# Altium schematic sheet P3V3_Regulator.SchDoc: P3V3 DC/DC Converter
size 431 x 279 mm; Organization: ORGANIZATION; Address1: APPLIED PHYSICS LAB; Address2: UNIVERSITY OF WASHINGTON; Address3: 1013 NE 40TH STREET; Address4: SEATTLE, WA 98105; DocumentNumber: 8; Revision: -; SheetNumber: 8; SheetTotal: 18; ENG_APP_DATE: --/--/--; DSN_APP_DATE: --/--/--; CHK_APP_DATE: --/--/--
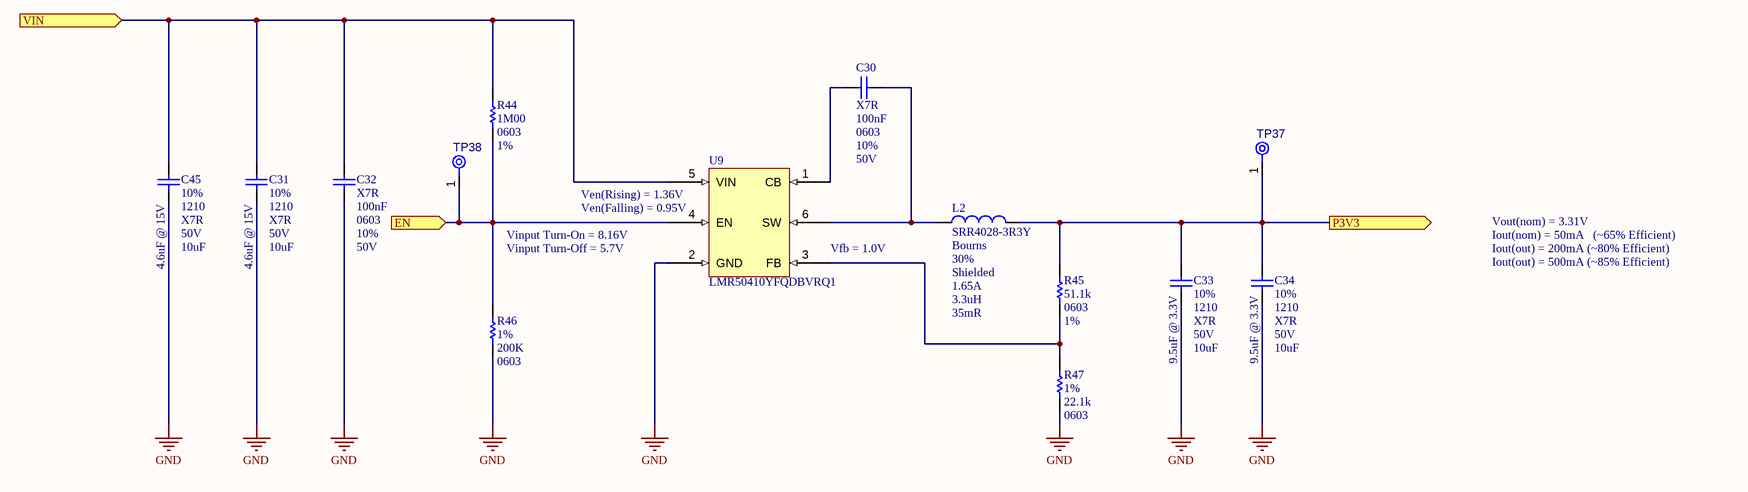
[diagram p0: P3V3_Regulator.SchDoc]

## Parts
C30  value 100nF  Dielectric: X7R  Case/Package: 0603  Tolerance: 10%  Voltage Rating: 50V  [CAPC1608X90X40ML10T20]  (hidden comment: Capacitor 100nF +/- 10%, 50V, X7R, 0603)
C31  value 10uF  Tolerance: 10%  Case/Package: 1210  Dielectric: X7R  Voltage Rating: 50V  [CAPC3225X270X30ML30]  (hidden comment: Capacitor 10uF 10%, 50V, X7R, 1210)
C32  value 100nF  Dielectric: X7R  Case/Package: 0603  Tolerance: 10%  Voltage Rating: 50V  [CAPC1608X90X40ML10T20]  (hidden comment: Capacitor 100nF +/- 10%, 50V, X7R, 0603)
C33  value 10uF  Tolerance: 10%  Case/Package: 1210  Dielectric: X7R  Voltage Rating: 50V  [CAPC3225X270X30ML30]  (hidden comment: Capacitor 10uF 10%, 50V, X7R, 1210)
C34  value 10uF  Tolerance: 10%  Case/Package: 1210  Dielectric: X7R  Voltage Rating: 50V  [CAPC3225X270X30ML30]  (hidden comment: Capacitor 10uF 10%, 50V, X7R, 1210)
C45  value 10uF  Tolerance: 10%  Case/Package: 1210  Dielectric: X7R  Voltage Rating: 50V  [CAPC3225X270X30ML30]  (hidden comment: Capacitor 10uF 10%, 50V, X7R, 1210)
L2  SRR4028-3R3Y  Manufacturer: Bourns  Inductance Tolerance: 30%  Shielding: Shielded  Saturation Current: 1.65A  Inductance: 3.3uH  DC Resistance (DCR): 35mR  [INDP4848X30M]
R44  value 1M00  Case/Package: 0603  Tolerance: 1%  [RESC1609X50X30ML08T20]  (hidden comment: Resistor 1M +/-1% 0603 100 mW)
R45  value 51.1k  Case/Package: 0603  Tolerance: 1%  [RESC1608X55X25ML10T15]  (hidden comment: Resistor 51K1 +/-1% 0603 100 mW)
R46  value 200K  Tolerance: 1%  Case/Package: 0603  [RESC1609X50X30ML08T20]  (hidden comment: Resistor 200K +/-1% 0603 100 mW)
R47  value 22.1k  Tolerance: 1%  Case/Package: 0603  [RESC1608X55X25ML10T15]  (hidden comment: Resistor 22K1 +/-1% 0603 100 mW)
TP37  TPAD6R-CIRCLED  [TP06R - Circled]  (value not drawn)  (no BOM)
TP38  TPAD6R-CIRCLED  [TP06R - Circled]  (value not drawn)  (no BOM)
U9  LMR50410YFQDBVRQ1  [SOT95P280X145-6M]

## Ports
EN (in), P3V3 (out), VIN (in)

## Nets
GND: C31.1 C32.1 C33.1 C34.1 C45.1 R46.1 R47.1 U9.2(GND)
EN: R44.1 R46.2 TP38.1(TP) U9.4(EN) ; port EN
P3V3: C33.2 C34.2 L2.2 R45.1 TP37.1(TP) ; port P3V3
VIN: C31.2 C32.2 C45.2 R44.2 U9.5(VIN) ; port VIN
NetC30_1: C30.1 L2.1 U9.6(SW)
NetC30_2: C30.2 U9.1(CB)
NetR45_2: R45.2 R47.2 U9.3(FB)

## Notes on the sheet
- Vinput Turn-On = 8.16V
- (near U9) Ven(Rising) = 1.36V
- (near U9) Ven(Falling) = 0.95V
- Vout(nom) = 3.31V
- Iout(nom) = 50mA   (~65% Efficient)
- (near C45) 4.6uF @ 15V
- (near C31) 4.6uF @ 15V
- Vinput Turn-Off = 5.7V
- Vfb = 1.0V
- Iout(out) = 200mA (~80% Efficient)
- Iout(out) = 500mA (~85% Efficient)
- (near C33) 9.5uF @ 3.3V
- (near C34) 9.5uF @ 3.3V
- THIS DOCUMENT AND THE DATA DISCLOSED HEREIN OR HEREWITH IS THE PROPERTY OF APPLIED PHYSICS LAB - UNIVERSITY OF WASHINGTON.
- PROJECT
- TITLE
- FILE NAME
- SIZE
- B
- CAGE CODE
- DWG NO.
- SHEET
- OF
- REV

## Library data of the parts
C30 C32 = CMP-001-00206-10: Chip Capacitor, 100nF, +/- 10%, 50 V, X7R 0603 (1608 Metric); Capacitor Type: Ceramic; Pins: 2; RoHS Compliant: True; Max Operating Temperature: 125°C; Capacitance: 100nF; Min Operating Temperature: -55°C; Decade: 100nF; Mount: Surface Mount
C31 C33 C34 C45 = CMP-001-00184-10: Chip Capacitor, 10uF, 10%, 50 V, X7R 1210 (3225 Metric); Capacitor Type: Ceramic; Min Operating Temperature: -55°C; Max Operating Temperature: 125°C; Capacitance: 10uF; Decade: 10uF; Pins: 2; RoHS Compliant: True; Mount: Surface Mount
L2 = CMP-006-00032-4: Inductor Power Shielded Wirewound 3.3uH 30% 7.72 Q-Factor Ferrite 1.65A Saturation 35mROhm DCR; Decade: 1uH; Current Rating: 2.15A; Q Factor: 7.72; Self Resonant Frequency: 76MHz; Mount: Surface Mount; Series: SRR4028; Core Material: Ferrite; Min Operating Temperature: -40°C; Max Operating Temperature: 125°C; Case/Package: 2020
R44 = CMP-009-01187-3: Chip Resistor, 1M Ohm, +/- 1%, 0.1 W, -55 to 155 degC, 0603 (1608 Metric); Decade: 1MEG; Power: 100mW; Voltage Rating: 75V; RoHS Compliant: Yes; Max Operating Temperature: 155°C; Pins: 2; Min Operating Temperature: -55°C; Mount: Surface Mount
R45 = CMP-009-01002-4: Chip Resistor, 51.1k Ohm, +/- 1%, 0.1 W, -55 to 155 degC, 0603 (1608 Metric); Voltage Rating: 75V; Decade: 10k; Power: 100mW; Pins: 2; RoHS Compliant: True; Max Operating Temperature: 155°C; Min Operating Temperature: -55°C; Mount: Surface Mount
R46 = CMP-009-00904-2: Chip Resistor, 200k Ohm, +/- 1%, 0.1 W, -55 to 155 degC, 0603 (1608 Metric); Power: 100mW; Voltage Rating: 75V; Decade: 100k; RoHS Compliant: Yes; Max Operating Temperature: 155°C; Pins: 2; Min Operating Temperature: -55°C; Mount: Surface Mount
R47 = CMP-009-00967-4: Chip Resistor, 22.1k Ohm, +/- 1%, 0.1 W, -55 to 155 degC, 0603 (1608 Metric); Decade: 10k; Power: 100mW; Voltage Rating: 75V; Min Operating Temperature: -55°C; Pins: 2; RoHS Compliant: True; Max Operating Temperature: 155°C; Mount: Surface Mount
TP37 TP38 = CMP-00028-00014-3: 0.6mm round with a silkscreen circle.; Pins: 1
U9 = CMP-019-00074-3: Automotive qualified SIMPLE SWITCHER 4-V to 36-V, 1-A synchronous step-down converter 6-SOT-23 -40 to 150; Max Input Voltage: 4V; Switching Frequency: 0.7MHz; Min Output Voltage: 28V; Max Output Current: 1; Min Input Voltage: 36V; Isolation: No; Max Output Voltage: 1V; Min Operating Temperature: +150; Isolation Voltage: N/A; Nominal Output Voltage: N/A; Case/Package: SOT-23-6; Mount: Surface Mount; Max Operating Temperature: -40; Max Power Dissipation: N/A